# Altium schematic sheet 06_POWER_5.SchDoc
size 420 x 297 mm; SheetNumber: 11; SheetTotal: 35
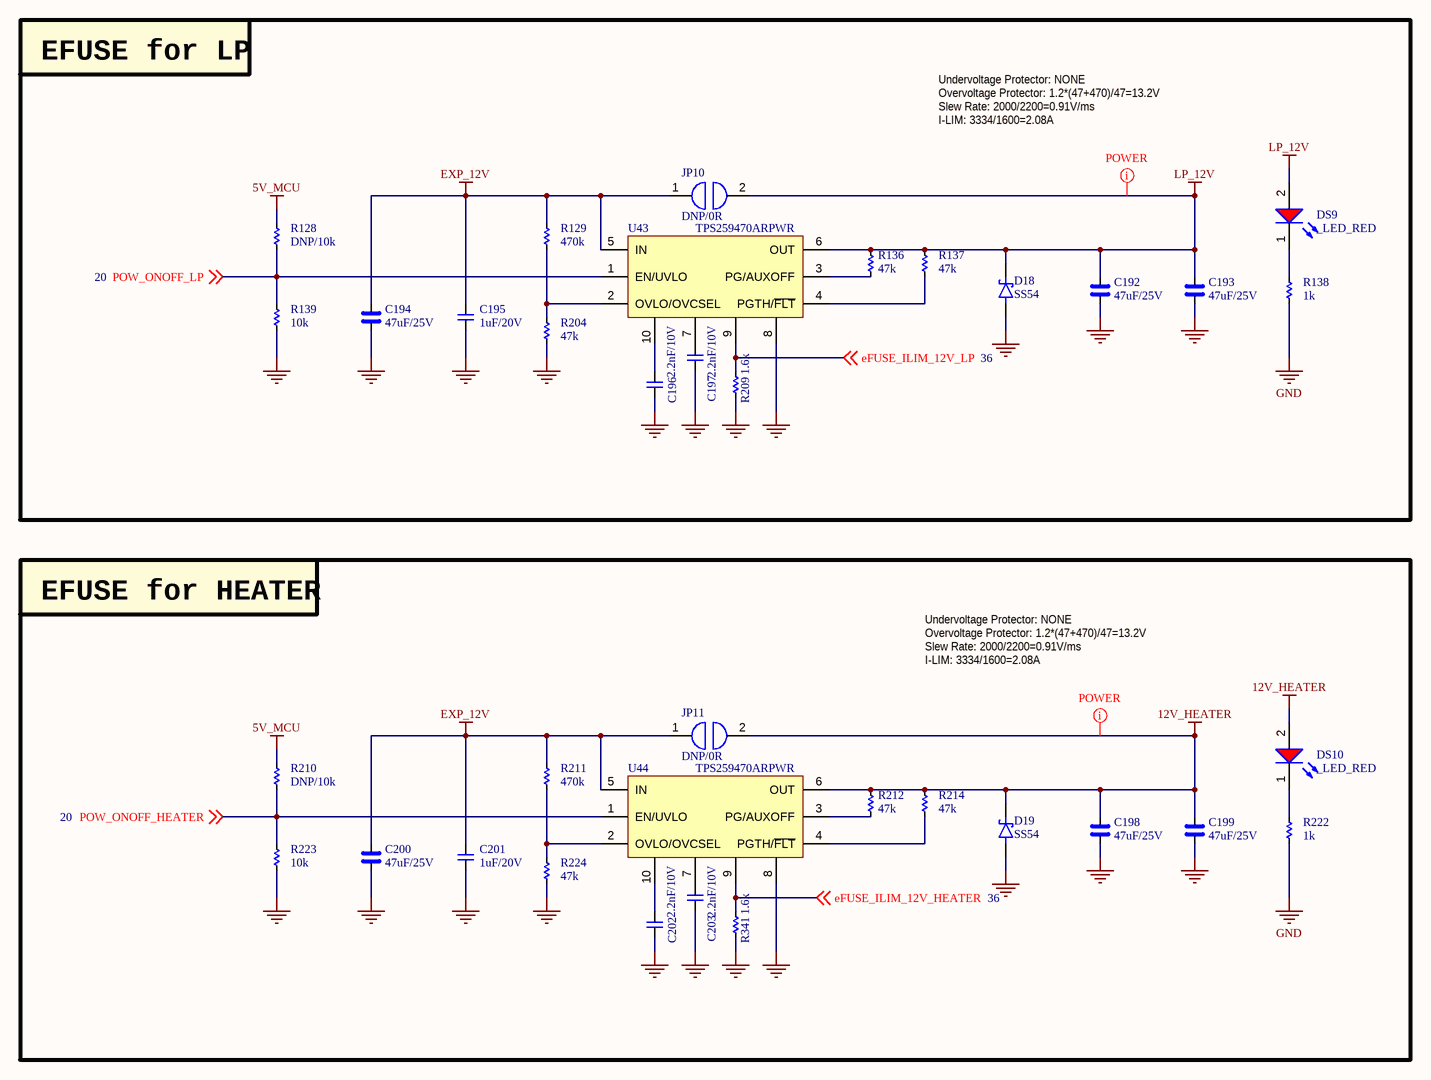
[diagram p0: 06_POWER_5.SchDoc]

## Parts
C192  47uF/25V  [CAP_C_3225X80]
C193  47uF/25V  [CAP_C_3225X80]
C194  47uF/25V  [CAP_C_3225X80]
C195  1uF/20V  [CAP_C_1005X60]
C196  2.2nF/10V  [CAP_C_1005X60]
C197  2.2nF/10V  [CAP_C_1005X60]
C198  47uF/25V  [CAP_C_3225X80]
C199  47uF/25V  [CAP_C_3225X80]
C200  47uF/25V  [CAP_C_3225X80]
C201  1uF/20V  [CAP_C_1005X60]
C202  2.2nF/10V  [CAP_C_1005X60]
C203  2.2nF/10V  [CAP_C_1005X60]
D18  SS54  [DO-214AC_SMA]
D19  SS54  [DO-214AC_SMA]
DS9  _LED_RED  [LED_0603]
DS10  _LED_RED  [LED_0603]
JP10  DNP/0R  [JUMPER_1608]
JP11  DNP/0R  [JUMPER_1608]
R128  DNP/10k  [RES_C_1005X40]
R129  470k  [RES_C_1005X40]
R136  47k  [RES_C_1005X40]
R137  47k  [RES_C_1005X40]
R138  1k  [RES_C_1005X40]
R139  10k  [RES_C_1005X40]
R204  47k  [RES_C_1005X40]
R209  1.6k  [RES_C_1005X40]
R210  DNP/10k  [RES_C_1005X40]
R211  470k  [RES_C_1005X40]
R212  47k  [RES_C_1005X40]
R214  47k  [RES_C_1005X40]
R222  1k  [RES_C_1005X40]
R223  10k  [RES_C_1005X40]
R224  47k  [RES_C_1005X40]
R341  1.6k  [RES_C_1005X40]
U43  TPS259470ARPWR  [VQFN-HR-10]
U44  TPS259470ARPWR  [VQFN-HR-10]

## Blocks framed on the sheet
EFUSE for LP: C192-C197 D18 DS9 JP10 R128 R129 R136-R139 R204 R209 U43
EFUSE for HEATER: C198-C203 D19 DS10 JP11 R210-R212 R214 R222-R224 R341 U44

## Nets
5V_MCU: R128.1 R210.1
12V_HEATER: C198.2 C199.2 D19.1(K) DS10.2(A) JP11.2 R212.2 R214.2 U44.6(OUT)
EXP_12V: C194.2 C195.2 C200.2 C201.2 JP10.1 JP11.1 R129.2 R211.2 U43.5(IN) U44.5(IN)
GND: C192.1 C193.1 C194.1 C195.1 C196.1 C197.1 C198.1 C199.1 C200.1 C201.1 C202.1 C203.1 D18.2(A) D19.2(A) R138.1 R139.2 R204.1 R209.1 R222.1 R223.2 R224.1 R341.1 U43.8 U44.8
LP_12V: C192.2 C193.2 D18.1(K) DS9.2(A) JP10.2 R136.2 R137.2 U43.6(OUT)
eFUSE_ILIM_12V_HEATER: R341.2 U44.9 ; off-sheet eFUSE_ILIM_12V_HEATER
eFUSE_ILIM_12V_LP: R209.2 U43.9 ; off-sheet eFUSE_ILIM_12V_LP
POW_ONOFF_HEATER: R210.2 R223.1 U44.1(EN/UVLO) ; off-sheet POW_ONOFF_HEATER
POW_ONOFF_LP: R128.2 R139.1 U43.1(EN/UVLO) ; off-sheet POW_ONOFF_LP
NetC196_2: C196.2 U43.10
NetC197_2: C197.2 U43.7
NetC202_2: C202.2 U44.10
NetC203_2: C203.2 U44.7
NetDS9_1: DS9.1(K) R138.2
NetDS10_1: DS10.1(K) R222.2
NetR129_1: R129.1 R204.2 U43.2(OVLO/OVCSEL)
NetR136_1: R136.1 U43.3(PG/AUXOFF)
NetR137_1: R137.1 U43.4(PGTH/~{FLT})
NetR211_1: R211.1 R224.2 U44.2(OVLO/OVCSEL)
NetR212_1: R212.1 U44.3(PG/AUXOFF)
NetR214_1: R214.1 U44.4(PGTH/~{FLT})

## Layout directives
net class POWER: 12V_HEATER, LP_12V

## Notes on the sheet
- Undervoltage Protector: NONE
- Overvoltage Protector: 1.2*(47+470)/47=13.2V
- Slew Rate: 2000/2200=0.91V/ms
- I-LIM: 3334/1600=2.08A
- Project:
- Sub-system:
- Design by:
- Sheet title:
- Sheet
- of
- Checked by:
- Approved by:
- Revision:
- Document No:
- Size:
- Date:
- A3

## Library data of the parts
C192-C194 C198-C200 = _CAP_C_High_2: CAP High Value
C195-C197 C201-C203 = _CAP_C_2: CAP
D18 D19 = DIODE SCHOTTKY
JP10 JP11 = JUMPER
R128 R129 R136-R139 R204 R209-R212 R214 R222-R224 R341 = _RES_B_2: RES